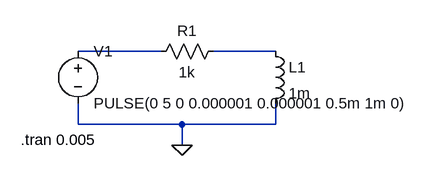
[diagram p0: schematic LR Series Circuit with Pulse Train.asc]
LR Series Circuit with Pulse Train.asc, the LTspice schematic file:
Version 4
SHEET 1 880 680
WIRE 160 128 32 128
WIRE 336 128 240 128
WIRE 32 240 32 208
WIRE 192 240 32 240
WIRE 336 240 336 208
WIRE 336 240 192 240
WIRE 192 272 192 240
FLAG 192 272 0
SYMBOL voltage 32 112 R0
WINDOW 123 0 0 Left 0
WINDOW 39 0 0 Left 0
SYMATTR InstName V1
SYMATTR Value PULSE(0 5 0 0.000001 0.000001 0.5m 1m 0)
SYMBOL res 256 112 R90
WINDOW 0 0 56 VBottom 2
WINDOW 3 32 56 VTop 2
SYMATTR InstName R1
SYMATTR Value 1k
SYMBOL ind 320 112 R0
SYMATTR InstName L1
SYMATTR Value 1m
TEXT -56 264 Left 2 !.tran 0.005

The netlist it stands for:
* LR Series Circuit with Pulse Train.asc
V1 N001 0 PULSE(0 5 0 0.000001 0.000001 0.5m 1m 0)
R1 N002 N001 1k
L1 N002 0 1m
.tran 0.005
.backanno
.end